# Altium schematic sheet p4_power_measure.SchDoc
size A1; Organization: Protel International P/L; Address1: L3, 12a Rodborough Rd; Address2: Frenchs Forest; Address3: NSW; Address4: Australia 2086
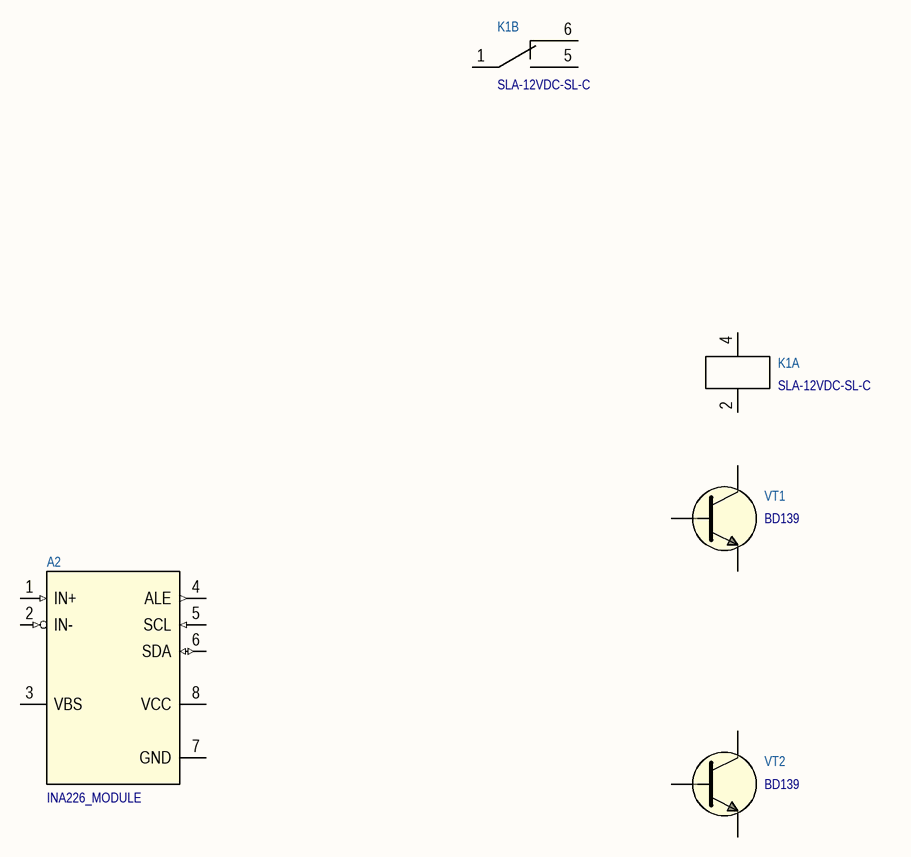
[diagram p0: p4_power_measure.SchDoc]

## Parts
A2  INA226_MODULE  [INA226_MODULE_VERT]
K1  SLA-12VDC-SL-C  [RELAY_32x27.5MM]  (parts A,B of 2)
VT1  BD139  [TO-126 (VERTICAL)]
VT2  BD139  [TO-126 (VERTICAL)]

## Nets

Not connected (* = marked no-connect by the designer): A2 1(IN+) 2(IN-) 3(VBS) 4(ALE) 5(SCL) 6(SDA) 7(GND) 8(VCC); K1 1 2 4 5 6; VT1 1(B) 2(C) 3(E); VT2 1(B) 2(C) 3(E)

## Notes on the sheet
- Title
- Size:
- Date:
- File:
- A1
- Number:
- Time:
- Revision:
- Sheet
- of

## Library data of the parts
A2 = INA226_MODULE: 20x20mm module with INA226; Part Number: INA226_MODULE
K1 = SLA-12VDC-SL-C: Subminature high power relay 4P 30A; Manufacturer: Songle Relay; Coil Power Dissipation: 0.9W; Coil Current: 12V@75mA; Coil Resistance: 160 Ohm; Package: 32mm x27.5mm; Part Number: SLA-12VDC-SL-C
VT1 VT2 = BD139: General Purpose n-p-n Transistors; Manufacturer: STMicroelectronics; Package: TO-126; Part Number: BD139